# EAGLE design SLAMP (EAGLE 7.7.0)

## Sheet 1 of 2
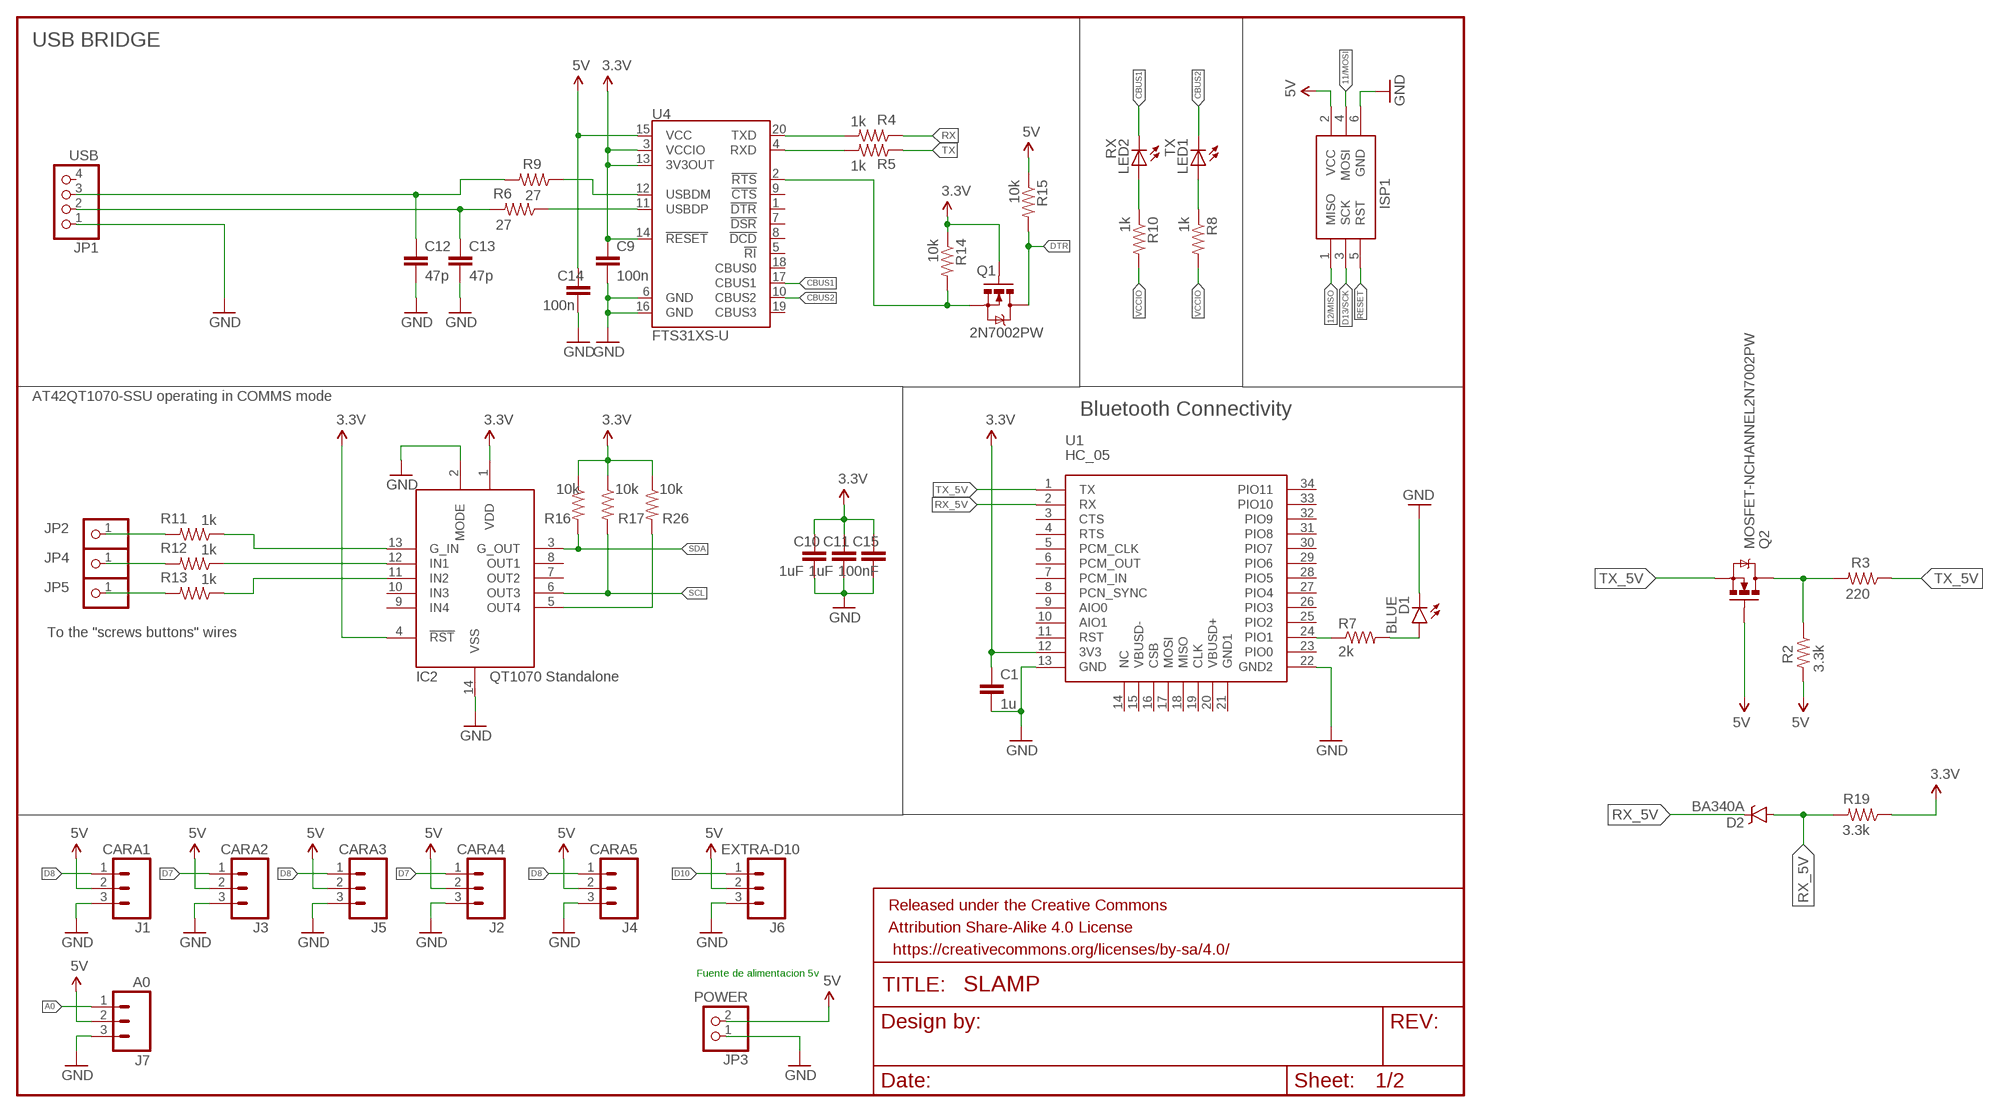
[diagram p0: schematic, sheet 1]

### Parts
C1  1u  CAP0603-CAP  [0603-CAP]
C9  100n  CAP0603-CAP  [0603-CAP]
C10  1uF  CAP0603-CAP  [0603-CAP]
C11  1uF  CAP0603-CAP  [0603-CAP]
C12  47p  CAP0603-CAP  [0603-CAP]
C13  47p  CAP0603-CAP  [0603-CAP]
C14  100n  CAP0603-CAP  [0603-CAP]
C15  100nF  CAP0603-CAP  [0603-CAP]
D1  BLUE  LED-BLUE0603  [LED-0603]
D2  BA340A  B340A  [SMA-DIODE]
FRAME1  FRAME-LETTERNO_PACKAGE  [DUMMY]
IC2  AT42QT1070-SSU  [SO14]
ISP1  AVRISP-6  [AVRISP]
J1  CARA1  M03JST-PTH-VERT  [JST-3-PTH-VERT]
J2  CARA4  M03JST-PTH-VERT  [JST-3-PTH-VERT]
J3  CARA2  M03JST-PTH-VERT  [JST-3-PTH-VERT]
J4  CARA5  M03JST-PTH-VERT  [JST-3-PTH-VERT]
J5  CARA3  M03JST-PTH-VERT  [JST-3-PTH-VERT]
J6  EXTRA-D10  M03JST-PTH-VERT  [JST-3-PTH-VERT]
J7  A0  M03JST-PTH-VERT  [JST-3-PTH-VERT]
JP1  USB  PINHD-1X4  [1X04]
JP2  PINHD-1X1  [1X01]
JP3  POWER  PINHD-1X2  [1X02]
JP4  PINHD-1X1  [1X01]
JP5  PINHD-1X1  [1X01]
LED1  TX  LEDCHIP-LED0603  [CHIP-LED0603]
LED2  RX  LEDCHIP-LED0603  [CHIP-LED0603]
Q1  2N7002PW  MOSFET-NCHANNEL2N7002PW  [SOT323]
Q2  MOSFET-NCHANNEL2N7002PW  [SOT323]
R2  3.3k  RESISTOR0603-RES  [0603-RES]
R3  220  RESISTOR0603-RES  [0603-RES]
R4  1k  RESISTOR0805-RES  [0805]
R5  1k  RESISTOR0805-RES  [0805]
R6  27  RESISTOR0603-RES  [0603-RES]
R7  2k  RESISTOR0805-RES  [0805]
R8  1k  RESISTOR0603-RES  [0603-RES]
R9  27  RESISTOR0603-RES  [0603-RES]
R10  1k  RESISTOR0603-RES  [0603-RES]
R11  1k  RESISTOR0603-RES  [0603-RES]
R12  1k  RESISTOR0603-RES  [0603-RES]
R13  1k  RESISTOR0603-RES  [0603-RES]
R14  10k  RESISTOR0805-RES  [0805]
R15  10k  RESISTOR0805-RES  [0805]
R16  10k  RESISTOR0603-RES  [0603-RES]
R17  10k  RESISTOR0603-RES  [0603-RES]
R19  3.3k  RESISTOR0603-RES  [0603-RES]
R26  10k  RESISTOR0603-RES  [0603-RES]
U1  HC_05  [BLUETOOTH_SMD]
U4  FTS31XS-U  FT231XS  [SSOP20_L]

### Nets
3.3V: C1.1 C9.1 C10.1 C11.1 C15.1 IC2.1(VDD) IC2.4(!RST) Q1.1(G) R14.1 R16.1 R17.1 R19.1 R26.1 U1.12(3V3) U4.3(VCCIO) U4.13(3V3OUT) U4.14(!RESET) ; also sheet 2
5V: C14.1 ISP1.2(VCC) J1.2 J2.2 J3.2 J4.2 J5.2 J6.2 J7.2 JP3.2 Q2.1(G) R2.2 R15.1 U4.15(VCC) ; also sheet 2
11/MOSI: ISP1.4(MOSI) ; also sheet 2
12/MISO: ISP1.1(MISO) ; also sheet 2
A0: J7.1 ; also sheet 2
CBUS1: LED2.C U4.17(CBUS1)
CBUS2: LED1.C U4.10(CBUS2)
D7: J2.1 J3.1 ; also sheet 2
D8: J1.1 J4.1 J5.1 ; also sheet 2
D10: J6.1 ; also sheet 2
D13/SCK: ISP1.3(SCK) ; also sheet 2
DTR: Q1.3(D) R15.2 ; also sheet 2
GND: C1.2 C9.2 C10.2 C11.2 C12.2 C13.2 C14.2 C15.2 D1.C IC2.2(MODE) IC2.14(VSS) ISP1.6(GND) J1.3 J2.3 J3.3 J4.3 J5.3 J6.3 J7.3 JP1.1 JP3.1 U1.13(GND) U1.22(GND2) U4.6(GND) U4.16(GND) ; also sheet 2
N$1: R7.1 U1.24(PIO1)
N$5: Q1.2(S) R14.2 U4.2(!RTS)
N$7: Q2.3(D) R2.1 R3.2
N$8: D1.A R7.2
N$9: LED1.A R8.1
N$10: LED2.A R10.1
N$11: IC2.13(G_IN) R11.1
N$12: IC2.12(IN1) R12.1
N$13: IC2.11(IN2) R13.1
N$14: R6.1 U4.11(USBDP)
N$15: R9.1 U4.12(USBDM)
N$16: C13.1 JP1.2 R6.2
N$17: C12.1 JP1.3 R9.2
N$19: JP2.1 R11.2
N$20: JP4.1 R12.2
N$21: JP5.1 R13.2
N$30: IC2.5(OUT4) R26.2
RESET: ISP1.5(RST) ; also sheet 2
RX: R4.1 R5.2 U4.4(RXD) ; also sheet 2
RX_5V: D2.A D2.C R19.2 U1.2(RX) ; also sheet 2
SCL: IC2.6(OUT3) R17.2 ; also sheet 2
SDA: IC2.3(G_OUT) R16.2 ; also sheet 2
TX: R4.2 R5.1 U4.20(TXD) ; also sheet 2
TX_5V: Q2.2(S) R3.1 U1.1(TX) ; also sheet 2
VCCIO: R8.2 R10.2
Unconnected: IC2.7(OUT2) IC2.8(OUT1) IC2.9(IN4) IC2.10(IN3) JP1.4 U1.3(CTS) U1.4(RTS) U1.5(PCM_CLK) U1.6(PCM_OUT) U1.7(PCM_IN) U1.8(PCN_SYNC) U1.9(AIO0) U1.10(AIO1) U1.11(RST) U1.14(NC) U1.15(VBUSD-) U1.16(CSB) U1.17(MOSI) U1.18(MISO) U1.19(CLK) U1.20(VBUSD+) U1.21(GND1) U1.23(PIO0) U1.25(PIO2) U1.26(PIO3) U1.27(PIO4) U1.28(PIO5) U1.29(PIO6) U1.30(PIO7) U1.31(PIO8) U1.32(PIO9) U1.33(PIO10) U1.34(PIO11) U4.1(!DTR) U4.5(!RI) U4.7(!DSR) U4.8(!DCD) U4.9(!CTS) U4.18(CBUS0) U4.19(CBUS3)

### Notes on the sheet
- USB BRIDGE
- AT42QT1070-SSU operating in COMMS mode
- Bluetooth Connectivity
- To the "screws buttons" wires
- Fuente de alimentacion 5v

## Sheet 2 of 2
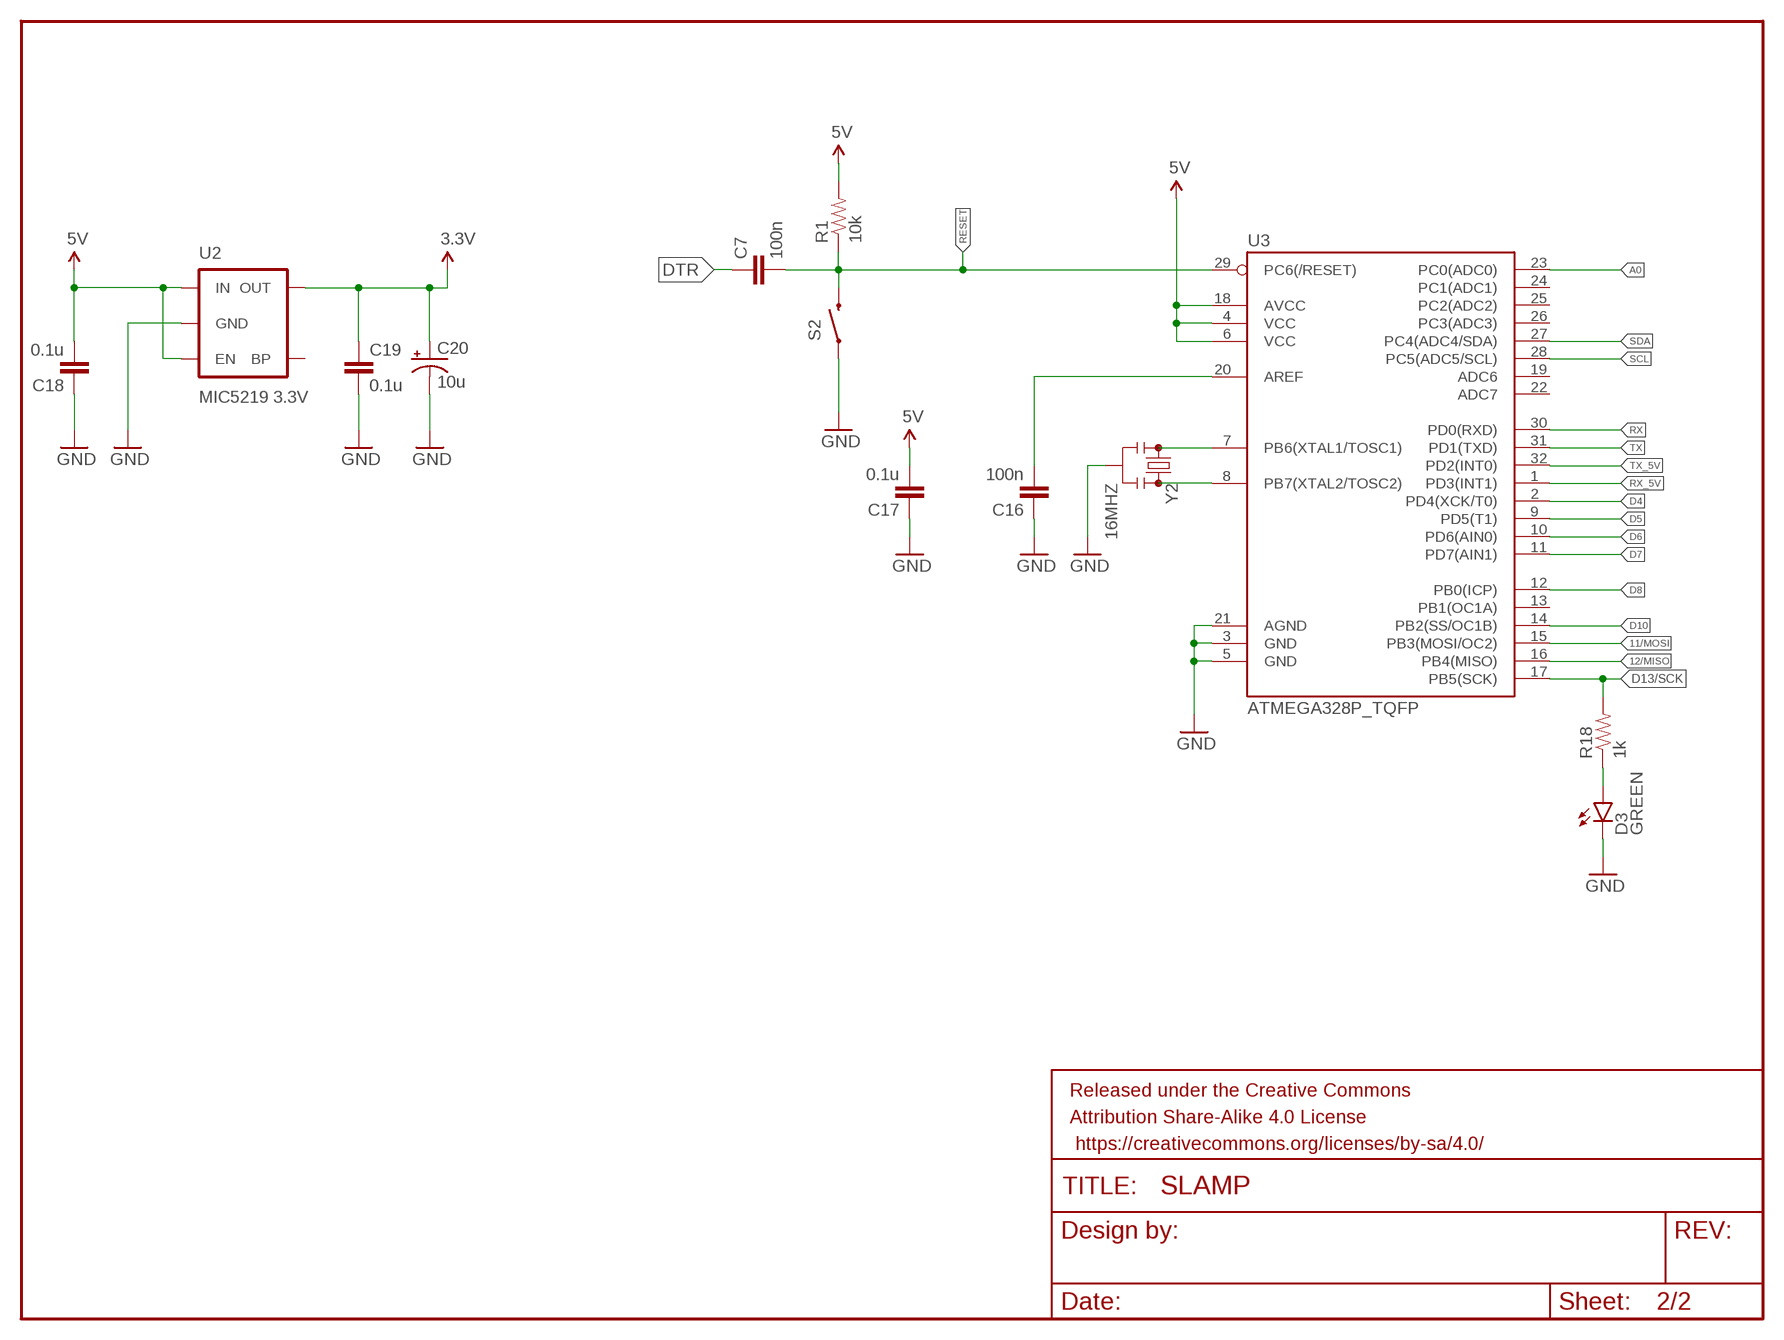
[diagram p1: schematic, sheet 2]

### Parts
C7  100n  CAP0805  [0805]
C16  100n  CAP0805  [0805]
C17  0.1u  CAP0805  [0805]
C18  0.1u  CAP0603-CAP  [0603-CAP]
C19  0.1u  CAP0603-CAP  [0603-CAP]
C20  10u  CPOL-USSMCP  [SMC_P]
D3  GREEN  LED-BLUE0603  [LED-0603]
FRAME2  FRAME-LETTERNO_PACKAGE  [DUMMY]
R1  10k  RESISTOR0805-RES  [0805]
R18  1k  RESISTOR0805-RES  [0805]
S2  SWITCH-MOMENTARY-2PTH  [TACTILE-PTH]
U2  MIC5219 3.3V  V_REG_MIC52193.3V  [SOT23-5]
U3  ATMEGA328P_TQFP  [TQFP32-08]
Y2  16MHZ  RESONATOR16MHZ  [RESONATOR-SMD]

### Nets
3.3V: C19.1 C20.+ U2.5(OUT) ; also sheet 1
5V: C17.2 C18.2 R1.2 U2.1(IN) U2.3(EN) U3.4(VCC) U3.6(VCC) U3.18(AVCC) ; also sheet 1
11/MOSI: U3.15(PB3(MOSI/OC2)) ; also sheet 1
12/MISO: U3.16(PB4(MISO)) ; also sheet 1
A0: U3.23(PC0(ADC0)) ; also sheet 1
D4: U3.2(PD4(XCK/T0))
D5: U3.9(PD5(T1))
D6: U3.10(PD6(AIN0))
D7: U3.11(PD7(AIN1)) ; also sheet 1
D8: U3.12(PB0(ICP)) ; also sheet 1
D10: U3.14(PB2(SS/OC1B)) ; also sheet 1
D13/SCK: R18.2 U3.17(PB5(SCK)) ; also sheet 1
DTR: C7.1 ; also sheet 1
GND: C16.1 C17.1 C18.1 C19.2 C20.- D3.C S2.1 U2.2(GND) U3.3(GND) U3.5(GND) U3.21(AGND) Y2.2 ; also sheet 1
N$2: U3.7(PB6(XTAL1/TOSC1)) Y2.1
N$3: U3.8(PB7(XTAL2/TOSC2)) Y2.3
N$4: C16.2 U3.20(AREF)
N$24: D3.A R18.1
RESET: C7.2 R1.1 S2.3 U3.29(PC6(/RESET)) ; also sheet 1
RX: U3.30(PD0(RXD)) ; also sheet 1
RX_5V: U3.1(PD3(INT1)) ; also sheet 1
SCL: U3.28(PC5(ADC5/SCL)) ; also sheet 1
SDA: U3.27(PC4(ADC4/SDA)) ; also sheet 1
TX: U3.31(PD1(TXD)) ; also sheet 1
TX_5V: U3.32(PD2(INT0)) ; also sheet 1
Unconnected: U2.4(BP) U3.13(PB1(OC1A)) U3.19(ADC6) U3.22(ADC7) U3.24(PC1(ADC1)) U3.25(PC2(ADC2)) U3.26(PC3(ADC3))

## Library data of the parts
C1 C7 C9-C19 = SparkFun-Passives:CAP: Capacitor Standard 0603 ceramic capacitor, and 0.1" leaded capacitor.
C20 = rcl:CPOL-US: POLARIZED CAPACITOR, American symbol
D1 = SparkFun-LED:LED-BLUE: Blue LEDs for production use Various blue LEDs stocked by SparkFun production 0603 - DIO-08575 Rebel - DIO-09553 1206 - DIO-09911; PROD_ID: DIO-08575
D2 = SparkFun-DiscreteSemi:B340A: Schottky Diode 3A-40V; PROD_ID: DIO-09886
D3 = SparkFun-LED:LED-BLUE: Blue LEDs for production use Various blue LEDs stocked by SparkFun production 0603 - DIO-08575 Rebel - DIO-09553 1206 - DIO-09911; PROD_ID: DIO-08575; VALUE: BLUE
FRAME1 FRAME2 = SparkFun-Aesthetics:FRAME-LETTER: Schematic Frame Standard 8.5x11 US Letter frame; DESIGNER: Nobody; VERSION: v01
IC2 = adafruit:AT42QT1070: QTouch 5-channel standalone sensor IC AT42QT1070 in standalone mode has 5 inputs (guard + 4 key) and open drain outputs. 1.8V-5.5V power.
ISP1 = adafruit:AVRISP: AVR ISP HEADER Standard 6 pin header for AVR programming
J1-J7 = SparkFun-Connectors:M03: Header 3 Standard 3-pin 0.1" header. Use with straight break away headers (SKU : PRT-00116), right angle break away headers (PRT-00553), swiss pins (PRT-00743), machine pins (PRT-00117), and female headers (PRT-00115). Molex polarized connector foot print use with SKU : PRT-08232 with associated crimp pins and housings.
JP1 = pinhead:PINHD-1X4: PIN HEADER
JP2 JP4 JP5 = adafruit:PINHD-1X1: Pin header 1x1 for 0.1" spacing With round pins
JP3 = pinhead:PINHD-1X2: PIN HEADER
LED1 LED2 = led:LED: LED OSRAM: - CHIPLED LG R971, LG N971, LY N971, LG Q971, LY Q971, LO R971, LY R971 LH N974, LH R974 LS Q976, LO Q976, LY Q976 LO Q996 - Hyper CHIPLED LW Q18S LB Q993, LB Q99A, LB R99A - SideLED LS A670, LO A670, LY A670, LG A670, LP A670 LB A673, LV A673, LT A673, LW A673 LH A674 LY A675 LS A676, LA A676, LO A676, LY A676, LW A676 LS A679, LY A679, LG A679 - Hyper Micro SIDELED® LS Y876, LA Y876, LO Y876, LY Y876 LT Y87S - SmartLED LW L88C, LW L88S LB L89C, LB L89S, LG L890 LS L89K, LO L89K, LY L89K LS L896, LA L896, LO L896, LY L896 - TOPLED LS T670, LO T670, LY T670, LG T670, LP T670 LSG T670, LSP T670, LSY T670, LOP T670, LYG T670 LG T671, LOG T671, LSG T671 LB T673, LV T673, LT T673, LW T673 LH T674 LS T676, LA T676, LO T676, LY T676, LB T676, LH T676, LSB T676, LW T676 LB T67C, LV T67C, LT T67C, LS T67K, LO T67K, LY T67K, LW E67C LS E67B, LA E67B, LO E67B, LY E67B, LB E67C, LV E67C, LT E67C LW T67C LS T679, LY T679, LG T679 LS T770, LO T770, LY T770, LG T770, LP T770 LB T773, LV T773, LT T773, LW T773 LH T774 LS E675, LA E675, LY E675, LS T675 LS T776, LA T776, LO T776, LY T776, LB T776 LHGB T686 LT T68C, LB T68C - Hyper Mini TOPLED® LB M676 - Mini TOPLED Santana® LG M470 LS M47K, LO M47K, LY M47K Source: http://www.osram.convergy.de LUXEON: - LUMILED® LXK2-PW12-R00, LXK2-PW12-S00, LXK2-PW14-U00, LXK2-PW14-V00 LXK2-PM12-R00, LXK2-PM12-S00, LXK2-PM14-U00 LXK2-PE12-Q00, LXK2-PE12-R00, LXK2-PE12-S00, LXK2-PE14-T00, LXK2-PE14-U00 LXK2-PB12-K00, LXK2-PB12-L00, LXK2-PB12-M00, LXK2-PB14-N00, LXK2-PB14-P00, LXK2-PB14-Q00 LXK2-PR12-L00, LXK2-PR12-M00, LXK2-PR14-Q00, LXK2-PR14-R00 LXK2-PD12-Q00, LXK2-PD12-R00, LXK2-PD12-S00 LXK2-PH12-R00, LXK2-PH12-S00 LXK2-PL12-P00, LXK2-PL12-Q00, LXK2-PL12-R00 Source: www.luxeon.com KINGBRIGHT: KA-3528ASYC Source: www.kingbright.com
Q1 Q2 = SparkFun-DiscreteSemi:MOSFET-NCHANNEL: Common NMOSFET Parts MFG P/N Store ID Prod ID FDD8780 TRANS-09984 SI7820DN TRANS-11055 FDS6630A IC-08089 2N7002PW TRANS-11151 FQP30N06L COM-10213 TRANS-10060 BSS123LT1G TRANS-08345 BSS138 TRANS-00830 BS170 2N7000; PROD_ID: TRANS-11151
R1-R19 R26 = SparkFun-Passives:RESISTOR: Resistor Basic schematic elements and footprints for 0603, 1206, and PTH resistors.
S2 = SparkFun-Electromechanical:SWITCH-MOMENTARY-2: Various NO switches- pushbuttons, reed, etc; PROD_ID: SWCH-08441
U1 = Bluetooth HC-05:HC_05: HC-05 Bluetooth Module
U2 = SparkFun-PowerIC:V_REG_MIC5219: V_REG MIC5219 Standard 3.3V and 5V 500mA LDO voltage regulator in SOT-23 layout. Micrel part MIC5219. BP (by-pass) pin is used to lower output noise with 470pF cap, may be left open.; PROD_ID: VREG-09872
U3 = SparkFun-DigitalIC:ATMEGA328P_TQFP; PROD_ID: IC-09069
U4 = SparkFun-DigitalIC:FT231X: FTDI FT231X Full Speed USB to Full-handshake UART This USB2.0 Full Speed IC offers a compact bridge to full handshake UART interfaces. The device is a UART, capable of operating up to 3MBaud, with low power consumption (8mA). The FT231X includes the complete FT-X series feature set and enables USB to be added into a system design quickly and easily over a UART interface.; PROD_ID: IC-11524
Y2 = SparkFun-FreqCtrl:RESONATOR: Resonator Small SMD resonator. Used, eg, on the Arduino Pro/ Pro Mini boards. 8MHz- XTAL-08895 16MHz- XTAL-08900; PROD_ID: XTAL-08900

## Board
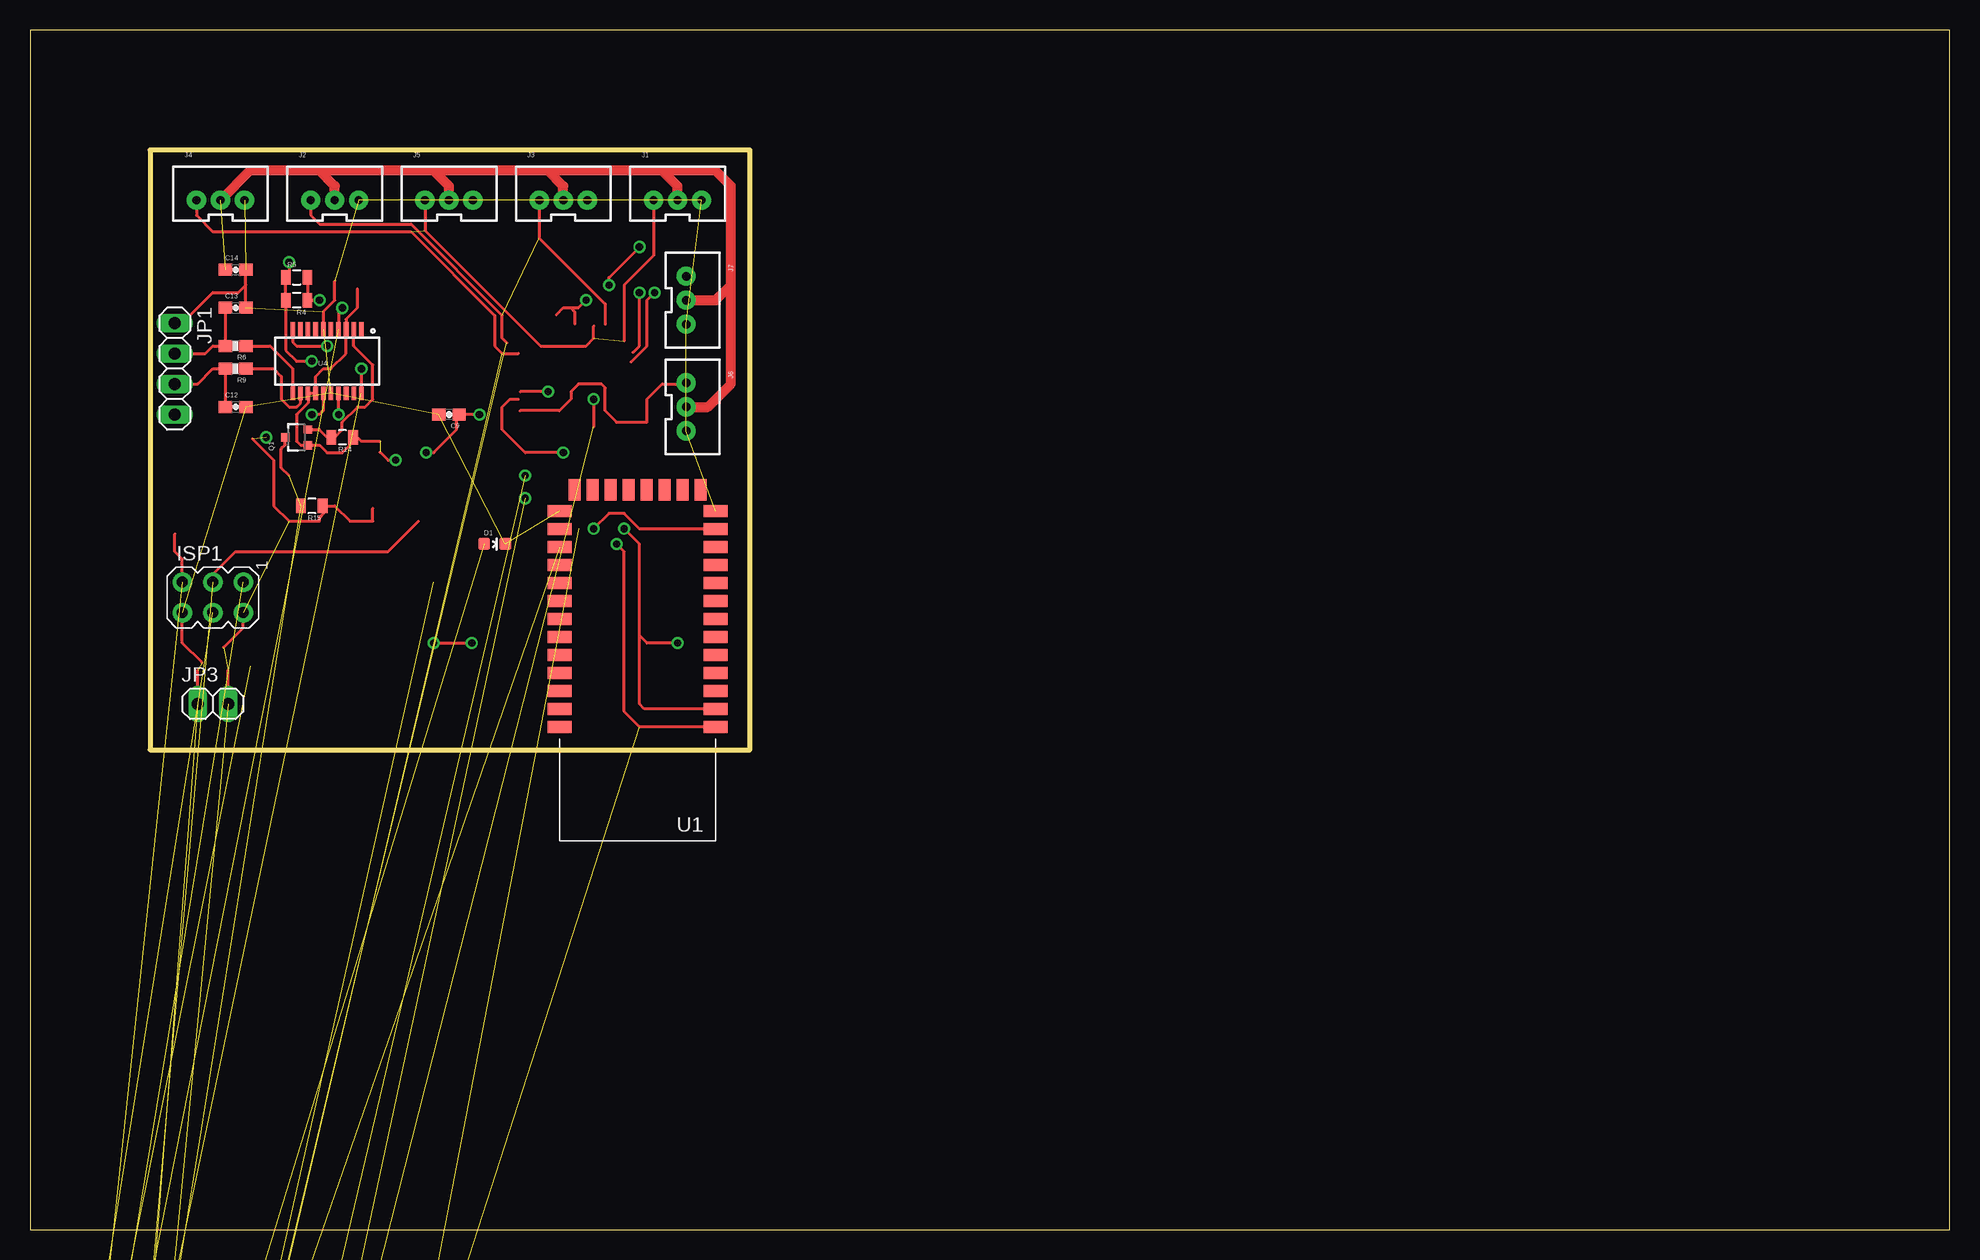
[diagram p2: board, top side]
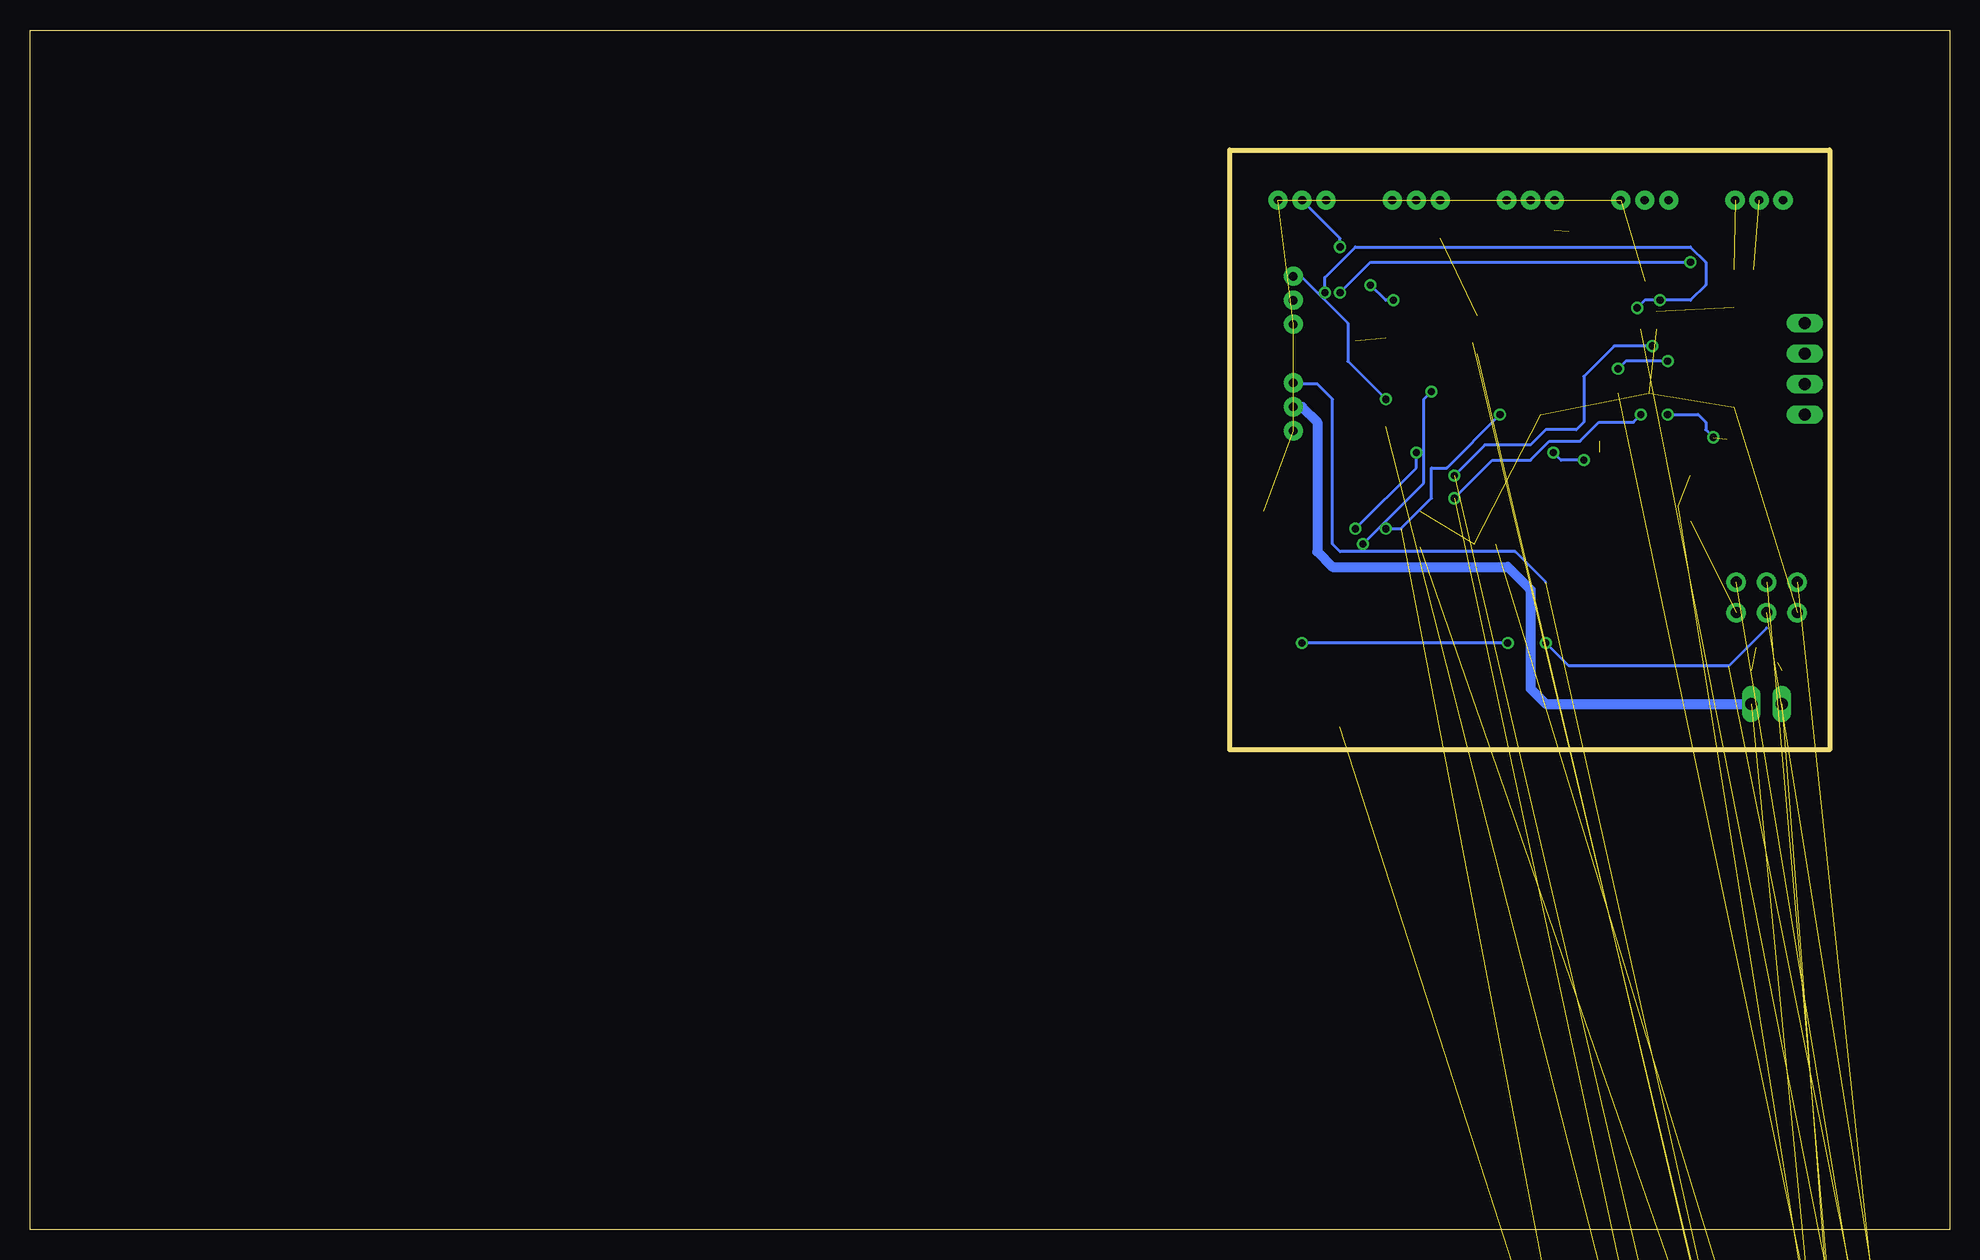
[diagram p3: board, bottom side, seen from below]

Size 160 x 100 mm. Coordinates in mm from the lower left corner, seen from the top.
Outline: 0,0 160,0 160,100 0,100 0,0
Outline: 10,90 10,40 60,40 60,90 10,90
Copper layers (1*16): Top 0.035mm / dielectric 1.5mm / Bottom 0.035mm
Design rules "default": minimum track width 10mil, minimum drill 24mil, track to track 8mil, track to pad 8mil, pad to pad 8mil, via to via 8mil, smd to smd 8mil, copper to edge 40mil, drill to drill 8mil, minimum pad ring 10mil, minimum via ring 8mil, stop-mask expansion 4mil, vias tented up to drill 0mil, thermal gap 10mil

### Footprints (pad centres in the part's own frame; a part is rotated, then mirrored left to right if it is on the bottom)
0603-CAP = smd 1.1 x 1: 1 -0.85,0; 2 0.85,0
0805 = smd 0.8 x 1.2: 1 -0.9,0; 2 0.9,0
SMC_P = smd 1.6 x 1.4: + -1.575,0; - 1.575,0
LED-0603 = smd 1 x 1: A 0,-0.877; C 0,0.877
SMA-DIODE = smd 1.27 x 1.47: A -2.15,0; C 2.15,0
SO14 = smd 0.66 x 2.032: 1 -3.81,-3.073; 2 -2.54,-3.073; 3 -1.27,-3.073; 4 0,-3.073; 5 1.27,-3.073; 6 2.54,-3.073; 7 3.81,-3.073; 8 3.81,3.073; 9 2.54,3.073; 10 1.27,3.073; 11 0,3.073; 12 -1.27,3.073; 13 -2.54,3.073; 14 -3.81,3.073
AVRISP = drill 0.9 pad 1.626: 1 -1.27,2.54; 2 1.27,2.54; 3 -1.27,0; 4 1.27,0; 5 -1.27,-2.54; 6 1.27,-2.54
JST-3-PTH-VERT = drill 0.7 pad 1.6: 1 -2,-0.55; 2 0,-0.55; 3 2,-0.55
1X04 = drill 1.016 long: 1 -3.81,0; 2 -1.27,0; 3 1.27,0; 4 3.81,0
1X01 = drill 1.016 pad 1.93 octagon: 1 0,0
1X02 = drill 1.016 long: 1 -1.27,0; 2 1.27,0
CHIP-LED0603 = smd 0.8 x 0.8: A 0,-0.75; C 0,0.75
SOT323 = smd 0.7 x 0.7: 1 -0.65,-0.925; 2 0.65,-0.925; 3 0,0.925
0603-RES = smd 1.1 x 1: 1 -0.85,0; 2 0.85,0
TACTILE-PTH = drill 1.016 pad 1.88: 1 -3.251,2.261; 2 3.251,2.261; 3 -3.251,-2.261; 4 3.251,-2.261
BLUETOOTH_SMD = smd 2 x 1: 1 -6.35,3.81; 2 -6.35,2.31; 3 -6.35,0.81; 4 -6.35,-0.69; 5 -6.35,-2.19; 6 -6.35,-3.69; 7 -6.35,-5.19; 8 -6.35,-6.69; 9 -6.35,-8.19; 10 -6.35,-9.69; 11 -6.35,-11.19; 12 -6.35,-12.69; 13 -6.35,-14.19; 22 6.65,-14.19; 23 6.65,-12.69; 24 6.65,-11.19; 25 6.65,-9.69; 26 6.65,-8.19; 27 6.65,-6.69; 28 6.65,-5.19; 29 6.65,-3.69; 30 6.65,-2.19; 31 6.65,-0.69; 32 6.65,0.81; 33 6.65,2.31; 34 6.65,3.81 | smd 1 x 1.8: 14 -5.1,-15.94; 15 -3.6,-15.94; 16 -2.1,-15.94; 17 -0.6,-15.94; 18 0.9,-15.94; 19 2.4,-15.94; 20 3.9,-15.94; 21 5.4,-15.94
SOT23-5 = smd 0.55 x 1.2: 1 -0.95,-1.3; 2 0,-1.3; 3 0.95,-1.3; 4 0.95,1.3; 5 -0.95,1.3
TQFP32-08 = smd 1.27 x 0.559: 1 -4.293,2.8; 2 -4.293,2; 3 -4.293,1.2; 4 -4.293,0.4; 5 -4.293,-0.4; 6 -4.293,-1.2; 7 -4.293,-2; 8 -4.293,-2.8; 17 4.293,-2.8; 18 4.293,-2; 19 4.293,-1.2; 20 4.293,-0.4; 21 4.293,0.4; 22 4.293,1.2; 23 4.293,2; 24 4.293,2.8 | smd 0.559 x 1.27: 9 -2.8,-4.293; 10 -2,-4.293; 11 -1.2,-4.293; 12 -0.4,-4.293; 13 0.4,-4.293; 14 1.2,-4.293; 15 2,-4.293; 16 2.8,-4.293; 25 2.8,4.293; 26 2,4.293; 27 1.2,4.293; 28 0.4,4.293; 29 -0.4,4.293; 30 -1.2,4.293; 31 -2,4.293; 32 -2.8,4.293
SSOP20_L = smd 0.381 x 1.143: 1 -2.857,-2.68; 2 -2.223,-2.68; 3 -1.587,-2.68; 4 -0.953,-2.68; 5 -0.318,-2.68; 6 0.318,-2.68; 7 0.953,-2.68; 8 1.587,-2.68; 9 2.223,-2.68; 10 2.857,-2.68; 11 2.857,2.68; 12 2.223,2.68; 13 1.587,2.68; 14 0.953,2.68; 15 0.318,2.68; 16 -0.318,2.68; 17 -0.953,2.68; 18 -1.587,2.68; 19 -2.223,2.68; 20 -2.857,2.68
RESONATOR-SMD = smd 0.45 x 1.905: 1 -1.2,0; 2 0,0; 3 1.2,0

### Placement (x,y rotation side)
C1  -35.56,-238.76 0 top  (outside the outline)
C7  -23.5,-233.68 0 top  (outside the outline)
C9  34.92,67.94 180 top
C10  13.97,-181.61 0 top  (outside the outline)
C11  -21.59,-188.59 0 top  (outside the outline)
C12  17.14,68.58 0 top
C13  17.14,76.83 0 top
C14  17.14,80.01 0 top
C15  -15.88,-188.59 0 top  (outside the outline)
C16  -20.32,-233.68 0 top  (outside the outline)
C17  -17.14,-233.68 0 top  (outside the outline)
C18  -3.17,-233.04 0 top  (outside the outline)
C19  2.54,-233.04 0 top  (outside the outline)
C20  -2.54,-220.98 0 top  (outside the outline)
D1  38.73,57.15 270 top
D2  -39.37,-249.56 0 top  (outside the outline)
D3  -7.62,-233.04 0 top  (outside the outline)
FRAME1  -24.13,-193.68 0 top  (outside the outline)
FRAME2  -24.77,-236.22 0 top  (outside the outline)
IC2  1.91,-167 0 top  (outside the outline)
ISP1  15.24,52.7 270 top
J1  53.98,86.36 0 top
J2  25.4,86.36 0 top
J3  44.45,86.36 0 top
J4  15.88,86.36 0 top
J5  34.92,86.36 0 top
J6  55.24,68.58 270 top
J7  55.24,77.47 270 top
JP1  12.06,71.75 270 top
JP2  -14.61,-150.5 0 top  (outside the outline)
JP3  15.24,43.81 0 top
JP4  5.08,-150.5 0 top  (outside the outline)
JP5  -14.61,-170.18 0 top  (outside the outline)
LED1  -16.51,-184.78 0 top  (outside the outline)
LED2  -11.43,-184.78 0 top  (outside the outline)
Q1  22.23,66.04 90 top
Q2  -40.64,-238.76 0 top  (outside the outline)
R1  -13.97,-233.68 0 top  (outside the outline)
R2  -39.37,-241.94 0 top  (outside the outline)
R3  -39.37,-245.11 0 top  (outside the outline)
R4  22.23,77.47 180 top
R5  22.23,79.38 0 top
R6  17.14,73.66 180 top
R7  -22.86,-138.43 0 top  (outside the outline)
R8  -10.16,-188.59 0 top  (outside the outline)
R9  17.14,71.75 180 top
R10  -4.45,-188.59 0 top  (outside the outline)
R11  1.27,-188.59 0 top  (outside the outline)
R12  6.99,-188.59 0 top  (outside the outline)
R13  12.7,-188.59 0 top  (outside the outline)
R14  26.04,66.04 180 top
R15  23.5,60.33 180 top
R16  -21.59,-191.77 0 top  (outside the outline)
R17  -15.88,-191.77 0 top  (outside the outline)
R18  -10.79,-233.68 0 top  (outside the outline)
R19  -39.37,-253.37 0 top  (outside the outline)
R26  -10.16,-191.77 0 top  (outside the outline)
S2  -12.06,-206.38 0 top  (outside the outline)
U1  50.8,45.72 180 top
U2  -10.16,-221.62 0 top  (outside the outline)
U3  -32.38,-229.87 0 top  (outside the outline)
U4  24.77,72.39 180 top
Y2  3.81,-220.34 0 top  (outside the outline)

### Tracks (layer width: path | path; a pad name or v marks a point on that pad's centre or on a via)
3.3V  (via drill 0.6)  (14 unrouted)
  Top 0.254: 29.18,65.72 27.62,65.72 27.3,66.04 R14.1 26.67,65.78 26.67,65.41 26.04,64.77 24.77,64.77 24.14,65.39 Q1.1 23.14,65.41 22.54,65.41 22.23,65.72 22.23,67.94 23.18,68.9 U4.13 U4.14 23.81,71.12 24.45,71.75 25.08,71.75 26.35,73.03 U4.3 26.35,75.88 27.3,76.83 27.3,78.44 | 29.18,64.8 29.84,64.14 v30.48,64.14 | v33.02,64.77 33.66,64.77 35.56,66.67 35.56,67.73 C9.1 v37.47,67.94 | U1.12 50.81,58.41 49.53,59.69 48.26,59.69 v46.99,58.42
  Bottom 0.254: v30.48,64.14 32.38,64.14 v33.02,64.77 | v46.99,58.42 45.72,58.42 43.18,60.96 43.18,63.5 41.91,63.5 v37.47,67.94
5V  (via drill 0.6)  (14 unrouted)
  Top 0.254: 18.55,65.91 20.32,64.14 20.32,60.33 21.59,59.05 24.13,59.05 24.13,59.37 24.45,59.69 24.45,60.27 R15.1 25.4,60.33 26.67,59.05 28.57,59.05 28.57,60.11 | JP3.2 16.51,46.62 | 16.14,48.52 17.78,50.16 ISP1.2 | U4.15 24.45,68.26 24.13,67.94 v23.5,67.94 | 45.09,76.83 44.45,76.83 43.88,76.27 | 45.09,76.83 45.4,76.52 45.4,75.5 | 45.09,76.83 45.72,76.83 v46.35,77.47 | v48.26,78.74 48.26,79.38 v50.8,81.92
  Top 0.813: J6.2 56.52,68.58 58.42,70.48 58.42,78.74 | 58.42,78.74 58.42,87 57.15,88.27 52.7,88.27 | 52.7,88.27 43.18,88.27 | 43.18,88.27 33.66,88.27 | 33.66,88.27 24.13,88.27 | 24.13,88.27 18.33,88.27 J4.2 | J1.2 53.98,87 52.7,88.27 | J3.2 44.45,87 43.18,88.27 | J5.2 34.92,87 33.66,88.27 | 25.4,85.72 J2.2 25.4,87 24.13,88.27 | J7.2 57.15,77.47 58.42,78.74
  Bottom 0.254: v23.5,67.94 20.95,67.94 20.32,67.31 20.32,66.67 v19.68,66.04 | v46.35,77.47 46.99,77.47 v48.26,78.74 | v50.8,81.92 50.8,82.64 J1.2
  Bottom 0.813: J6.2 53.98,68.58 52.7,67.31 52.7,56.52 51.44,55.24 36.83,55.24 34.92,53.34 34.92,45.09 33.66,43.81 JP3.2
11/MOSI  (1 unrouted)
12/MISO  (1 unrouted)
A0  (via drill 0.6)  (1 unrouted)
  Top 0.254: v46.99,69.22 46.99,66.92
  Bottom 0.254: J7.1 54.07,79.47 50.16,75.56 50.16,72.39 v46.99,69.22
CBUS1  (via drill 0.6)  (1 unrouted)
  Top 0.254: v25.72,67.94 U4.17
  Bottom 0.254: v41.27,60.96 38.1,64.14 34.92,64.14 33.34,65.72 30.8,65.72 29.21,67.31 26.35,67.31 v25.72,67.94
CBUS2  (via drill 0.6)  (1 unrouted)
  Top 0.254: U4.10 21.91,73.98 22.23,73.66 v24.77,73.66
  Bottom 0.254: v24.77,73.66 27.94,73.66 30.48,71.12 30.48,67.31 31.11,66.67 33.66,66.67 34.92,65.41 38.73,65.41 v41.27,62.87
D7  (2 unrouted)
  Top 0.254: J2.1 23.4,84.55 24.13,83.82 31.75,83.82 39.37,76.2 39.37,74.3 39.74,73.92 | J3.1 42.45,82.64 47.94,77.15 47.94,75.47
D8  (3 unrouted)
  Top 0.254: J4.1 13.88,84.55 15.24,83.19 31.75,83.19 38.73,76.2 38.73,73.66 39.37,73.03 40.7,73.03 | J5.1 32.92,83.28 42.55,73.66 46.35,73.66 46.99,74.3 46.99,75.32 | J1.1 51.98,81.19 49.53,78.74 49.53,74.07
D10  (1 unrouted)
  Top 0.254: 40.85,68.26 44.13,68.26 45.09,69.22 45.09,69.85 45.72,70.48 47.62,70.48 47.94,70.17 47.94,68.26 48.9,67.31 51.44,67.31 51.44,69.22 52.7,70.48 54.6,70.48 J6.1
  Bottom 0.254: 33.66,53.98 36.2,56.52 50.8,56.52 51.44,57.15 51.44,69.22 52.7,70.48 54.6,70.48 J6.1
D13/SCK  (2 unrouted)
  Top 0.254: ISP1.3 15.24,54.61 17.14,56.52 29.84,56.52 32.38,59.05
DTR  (2 unrouted)
  Top 0.254: 21.59,62.87 20.95,63.5 20.95,65.09 21.27,65.41 21.27,66.01 Q1.3
GND  (34 unrouted)
  Top 0.254: U4.6 24.45,76.52 25.4,77.47 25.4,79.07 | C13.2 18,78.74 | 18,78.74 C14.2 | JP1.1 12.7,75.56 15.24,78.11 17.36,78.11 18,78.74 | JP3.1 13.97,46.62 | 14.34,47.26 12.7,48.9 ISP1.6
N$1  (1 unrouted)
N$2  (1 unrouted)
N$3  (1 unrouted)
N$4  (1 unrouted)
N$5
  Top 0.254: Q1.2 24.11,66.69 24.77,66.04 R14.2 25.4,66.04 26.04,66.67 26.04,67.31 27.3,68.58 27.94,68.58 28.57,69.22 28.57,72.07 26.99,73.66 U4.2
N$7  (2 unrouted)
N$8  (1 unrouted)
N$9  (1 unrouted)
N$10  (1 unrouted)
N$11  (1 unrouted)
N$12  (1 unrouted)
N$13  (1 unrouted)
N$14
  Top 0.254: R6.1 20,73.66 21.91,71.75 U4.11
N$15
  Top 0.254: R9.1 20.32,71.75 20.95,71.12 20.95,69.22 21.59,68.58 22.23,68.58 22.54,68.9 U4.12
N$16
  Top 0.254: JP1.2 14.61,73.03 15.24,73.66 R6.2 C13.1
N$17
  Top 0.254: JP1.3 13.97,70.48 15.24,71.75 R9.2 C12.1
N$19  (1 unrouted)
N$20  (1 unrouted)
N$21  (1 unrouted)
N$24  (1 unrouted)
N$30  (1 unrouted)
RESET  (4 unrouted)
  Top 0.254: ISP1.5 12.7,55.88 12.06,56.52 12.06,57.99
RX  (via drill 0.6)  (1 unrouted)
  Top 0.254: R5.2 R4.1 v24.13,77.47 | v26.04,76.83 25.72,76.52 U4.4 | 50.09,72.32 51.44,73.66 51.44,77.47 v52.07,78.11
  Bottom 0.254: v26.04,76.83 25.4,77.47 v24.13,77.47 21.59,77.47 20.32,78.74 20.32,80.64 21.59,81.92 49.53,81.92 52.07,79.38 v52.07,78.11
RX_5V  (via drill 0.6)  (4 unrouted)
  Top 0.254: U1.2 51.2,43.41 50.8,43.81 50.8,49.53 | 50.8,49.53 50.8,57.15 v49.53,58.42 | v44.45,64.77 41.27,64.77 39.37,66.67 39.37,68.58 40.01,69.22 40.7,69.22 | v33.66,48.9 v36.83,48.9 | v53.98,48.9 51.44,48.9 50.8,49.53
  Bottom 0.254: v49.53,58.42 44.45,63.5 v44.45,64.77 | 15.24,50.16 18.41,46.99 31.75,46.99 v33.66,48.9 | v36.83,48.9 v53.98,48.9
SCL  (2 unrouted)
SDA  (2 unrouted)
TX  (via drill 0.6)  (1 unrouted)
  Top 0.254: v23.5,72.39 22.23,72.39 21.32,73.29 R4.2 R5.1 21.59,79.64 v21.59,80.64 | v27.62,71.75 U4.20 | 50.26,73.12 50.8,73.66 v50.8,78.11
  Bottom 0.254: v23.5,72.39 26.99,72.39 v27.62,71.75 | v50.8,78.11 48.26,80.64 v21.59,80.64
TX_5V  (via drill 0.6)  (3 unrouted)
  Top 0.254: U1.1 50.8,41.91 49.53,43.18 49.53,56.52 v48.9,57.15 | v43.18,69.85 40.86,69.85
  Bottom 0.254: v48.9,57.15 43.81,62.23 43.81,69.22 v43.18,69.85
VCCIO  (1 unrouted)